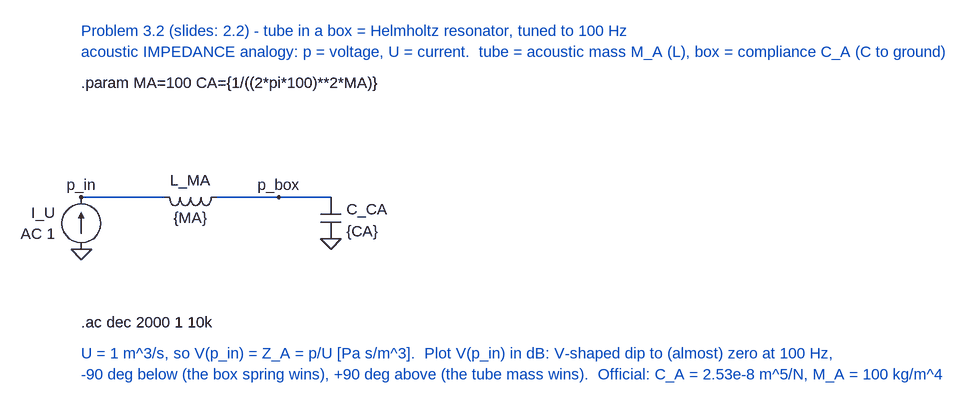
[diagram p0: schematic P3-2_Helmholtz_100Hz.asc]
P3-2_Helmholtz_100Hz.asc, the LTspice schematic file:
Version 4
SHEET 1 3000 1600
WIRE 0 0 128 0
WIRE 208 0 384 0
FLAG 0 80 0
FLAG 0 0 p_in
FLAG 304 0 p_box
FLAG 384 64 0
SYMBOL current 0 80 R180
WINDOW 0 40 56 Left 2
WINDOW 3 40 24 Left 2
SYMATTR InstName I_U
SYMATTR Value AC 1
SYMBOL ind 224 -16 R90
WINDOW 0 5 56 VBottom 2
WINDOW 3 32 56 VTop 2
SYMATTR InstName L_MA
SYMATTR Value {MA}
SYMATTR SpiceLine Rser=0
SYMBOL cap 368 0 R0
WINDOW 0 40 18 Left 2
WINDOW 3 40 52 Left 2
SYMATTR InstName C_CA
SYMATTR Value {CA}
TEXT 0 -256 Left 2 ;Problem 3.2 (slides: 2.2) - tube in a box = Helmholtz resonator, tuned to 100 Hz
TEXT 0 -224 Left 2 ;acoustic IMPEDANCE analogy: p = voltage, U = current.  tube = acoustic mass M_A (L), box = compliance C_A (C to ground)
TEXT 0 -176 Left 2 !.param MA=100 CA={1/((2*pi*100)**2*MA)}
TEXT 0 192 Left 2 !.ac dec 2000 1 10k
TEXT 0 240 Left 2 ;U = 1 m^3/s, so V(p_in) = Z_A = p/U [Pa s/m^3].  Plot V(p_in) in dB: V-shaped dip to (almost) zero at 100 Hz,
TEXT 0 272 Left 2 ;-90 deg below (the box spring wins), +90 deg above (the tube mass wins).  Official: C_A = 2.53e-8 m^5/N, M_A = 100 kg/m^4

The netlist it stands for:
* P3-2_Helmholtz_100Hz.asc
I_U 0 p_in AC 1
L_MA p_box p_in {MA} Rser=0
C_CA p_box 0 {CA}
* Problem 3.2 (slides: 2.2) - tube in a box = Helmholtz resonator, tuned to 100 Hz
* acoustic IMPEDANCE analogy: p = voltage, U = current.  tube = acoustic mass M_A (L), box = compliance C_A (C to ground)
.param MA=100 CA={1/((2*pi*100)**2*MA)}
.ac dec 2000 1 10k
* U = 1 m^3/s, so V(p_in) = Z_A = p/U [Pa s/m^3].  Plot V(p_in) in dB: V-shaped dip to (almost) zero at 100 Hz,
* -90 deg below (the box spring wins), +90 deg above (the tube mass wins).  Official: C_A = 2.53e-8 m^5/N, M_A = 100 kg/m^4
.backanno
.end